# Altium project E-Card.PrjPCB
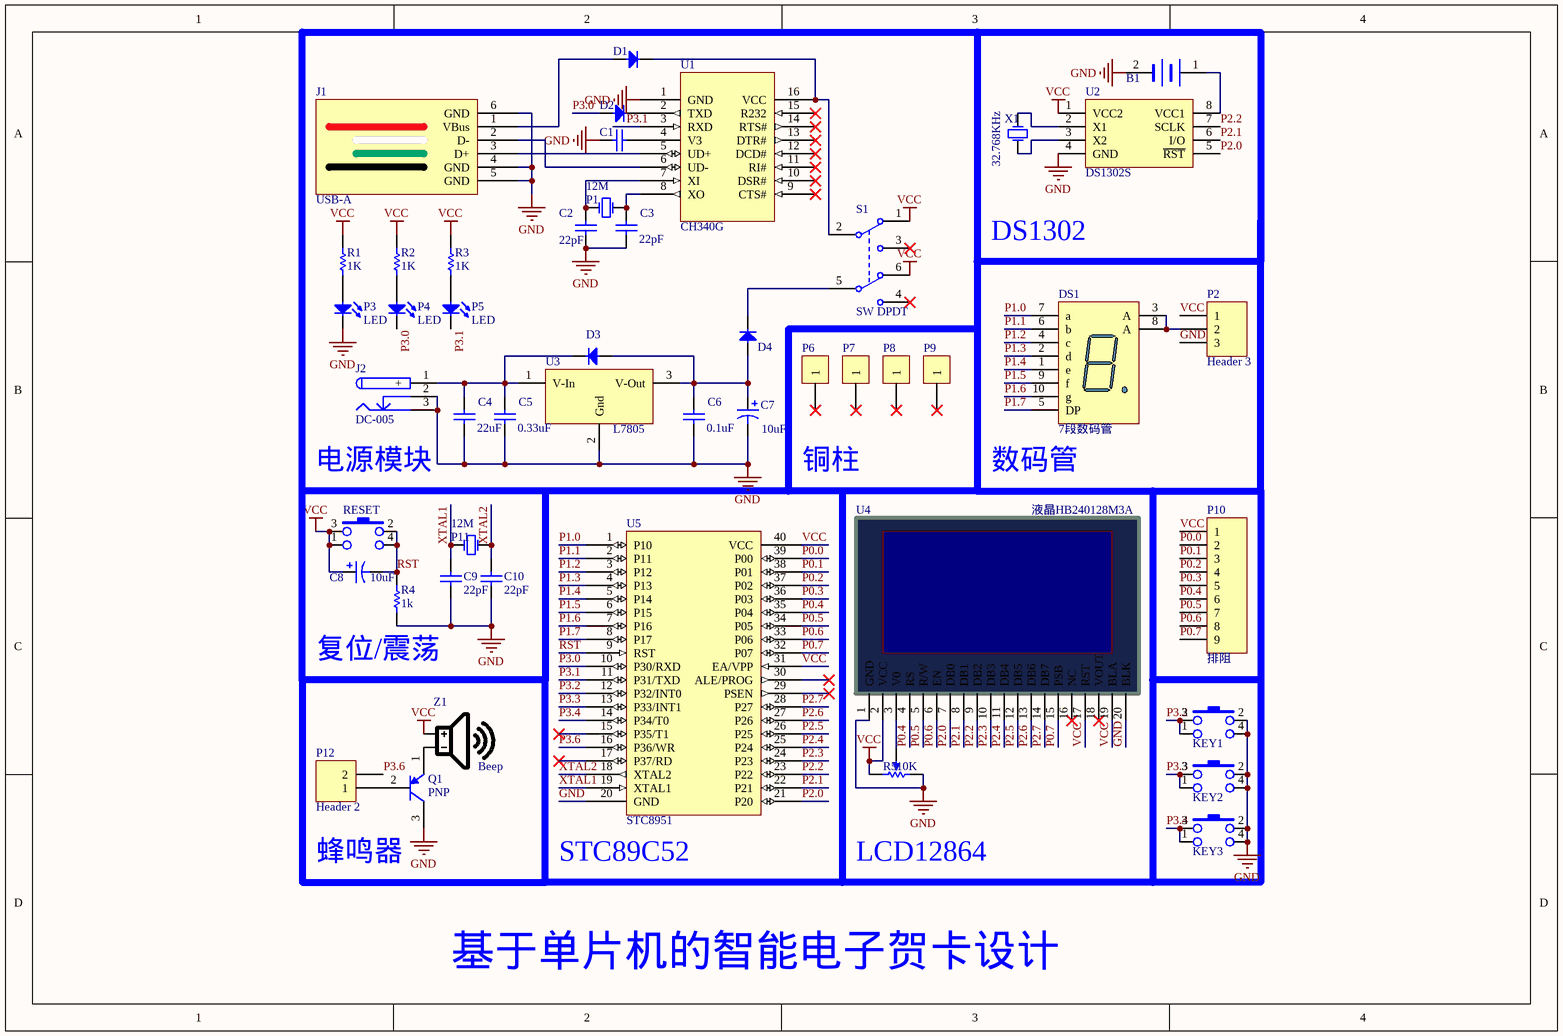
[diagram p0: E-Card.SchDoc]
1 sheet, 48 parts. Net scope: global (net labels, ports and power ports of the same name join across sheets).
Board file: E-Card.PcbDoc

## Sheet E-Card.SchDoc: 基于单片机的智能电子贺卡设计
size A4

### Parts
B1  CR1220  [BATTERY]  (value not drawn)
C1  0.1uF  [Cap]  (value not drawn)
C2  22pF  [Cap]
C3  22pF  [Cap]
C4  22uF  [Cap]
C5  0.33uF  [Cap]
C6  0.1uF  [Cap]
C7  10uF  [电解电容]
C8  10uF  [电解电容]
C9  22pF  [Cap]
C10  22pF  [Cap]
D1  Diode  [Diode]  (value not drawn)
D2  1N4007  [Diode]  (value not drawn)
D3  Diode  [Diode]  (value not drawn)
D4  Diode  [Diode]  (value not drawn)
DS1  7-Segment  [7-Segment]  (value not drawn)
J1  USB-A  [USB-A]
J2  DC-005  [DC JACK]
KEY1  SW-66B7  [SW-66]  (value not drawn)
KEY2  SW-66B7  [SW-66]  (value not drawn)
KEY3  SW-66B7  [SW-66]  (value not drawn)
P1  12M  [XTAL 12M]
P2  Header 3  [Header 3]
P3  LED  [LED]
P4  LED  [LED]
P5  LED  [LED]
P6  CU-M3X6-10  [CU-M3X6-10]  (value not drawn)
P7  CU-M3X6-10  [CU-M3X6-10]  (value not drawn)
P8  CU-M3X6-10  [CU-M3X6-10]  (value not drawn)
P9  CU-M3X6-10  [CU-M3X6-10]  (value not drawn)
P10  排阻  [排阻]
P11  12M  [XTAL 12M]
P12  Header 2  [Header 2]
Q1  PNP  [PNP]
R1  1K  [RES]
R2  1K  [RES]
R3  1K  [RES]
R4  1k  [RES]
R5  value 10K  [RPot]  (hidden comment: RPot)
RESET  SW-66B7  [SW-66]  (value not drawn)
S1  SW DPDT  [SW DPDT]
U1  CH340G  [CH340G]
U2  DS1302S  [DS1302]
U3  L7805  [L7805]
U4  液晶HB240128M3A  [LCD12864]
U5  STC8951  [STC8951]
X1  32.768KHz  [XTAL 32768]
Z1  Beep  [Beep]

### Nets
GND: B1.2(-) C1.1 C2.2 C3.2 C4.2 C5.2 C6.1 C7.2 C9.1 C10.1 J1.4(GND) J1.5(GND) J1.6(GND) J2.2 J2.3(-) KEY1.2 KEY1.4 KEY2.2 KEY2.4 KEY3.2 KEY3.4 P2.3 P3.2(K) Q1.3(C) R4.1 R5.2(TOP) U1.1(GND) U2.4(GND) U3.2(Gnd) U4.1(GND) U4.20(BLK) U5.20(GND)
VCC: C8.1 P2.1 P10.1 R1.2 R2.2 R3.2 R5.1(BOT) RESET.1 RESET.3 S1.1(NC1) S1.6(NC2) U2.1(VCC2) U4.2(VCC) U4.17(RST) U4.19(BLA) U5.31(EA/VPP) U5.40(VCC) Z1.1
P0.0: P10.2 U5.39(P00)
P0.1: P10.3 U5.38(P01)
P0.2: P10.4 U5.37(P02)
P0.3: P10.5 U5.36(P03)
P0.4: P10.6 U4.4(RS) U5.35(P04)
P0.5: P10.7 U4.5(R/W) U5.34(P05)
P0.6: P10.8 U4.6(EN) U5.33(P06)
P0.7: P10.9 U4.15(PSB) U5.32(P07)
P1.0: DS1.7(a) U5.1(P10)
P1.1: DS1.6(b) U5.2(P11)
P1.2: DS1.4(c) U5.3(P12)
P1.3: DS1.2(d) U5.4(P13)
P1.4: DS1.1(e) U5.5(P14)
P1.5: DS1.9(f) U5.6(P15)
P1.6: DS1.10(g) U5.7(P16)
P1.7: DS1.5(DP) U5.8(P17)
P2.0: U2.5(~{RST}) U4.7(DB0) U5.21(P20)
P2.1: U2.6(I/O) U4.8(DB1) U5.22(P21)
P2.2: U2.7(SCLK) U4.9(DB2) U5.23(P22)
P2.3: U4.10(DB3) U5.24(P23)
P2.4: U4.11(DB4) U5.25(P24)
P2.5: U4.12(DB5) U5.26(P25)
P2.6: U4.13(DB6) U5.27(P26)
P2.7: U4.14(DB7) U5.28(P27)
P3.0: D2.1(A) P4.2(K) U5.10(P30/RXD)
P3.1: P5.2(K) U1.3(RXD) U5.11(P31/TXD)
P3.2: KEY1.1 KEY1.3 U5.12(P32/INT0)
P3.3: KEY2.1 KEY2.3 U5.13(P33/INT1)
P3.4: KEY3.1 KEY3.3 U5.14(P34/T0)
P3.6: P12.2 U5.16(P36/WR)
RST: C8.2 R4.2 RESET.2 RESET.4 U5.9(RST)
XTAL1: C9.2 P11.1(OSC1) U5.19(XTAL1)
XTAL2: C10.2 P11.2(OSC2) U5.18(XTAL2)
NetB1_1: B1.1(+) U2.8(VCC1)
NetC1_2: C1.2 U1.4(V3)
NetC2_1: C2.1 P1.1(OSC1) U1.7(XI)
NetC3_1: C3.1 P1.2(OSC2) U1.8(XO)
NetC4_1: C4.1 C5.1 D3.2(K) J2.1(+) U3.1(V-In)
NetC6_2: C6.2 C7.1 D3.1(A) D4.1(A) U3.3(V-Out)
NetD1_1: D1.1(A) J1.1(VBus)
NetD1_2: D1.2(K) S1.2(COMMON1) U1.16(VCC)
NetD2_2: D2.2(K) U1.2(TXD)
NetD4_2: D4.2(K) S1.5(COMMON2)
NetDS1_3: DS1.3(A) DS1.8(A) P2.2
NetJ1_2: J1.2(D-) U1.6(UD-)
NetJ1_3: J1.3(D+) U1.5(UD+)
NetP3_1: P3.1(A) R1.1
NetP4_1: P4.1(A) R2.1
NetP5_1: P5.1(A) R3.1
NetP12_1: P12.1 Q1.2(B)
NetQ1_1: Q1.1(E) Z1.2
NetR5_3: R5.3(TAP) U4.3(V0)
NetU2_2: U2.2(X1) X1.1
NetU2_3: U2.3(X2) X1.2

Not connected (* = marked no-connect by the designer): P6 1*; P7 1*; P8 1*; P9 1*; S1 3(NO1)* 4(NO2)*; U1 9(CTS#)* 10(DSR#)* 11(RI#)* 12(DCD#)* 13(DTR#)* 14(RTS#)* 15(R232)*; U4 16(NC)* 18(VOUT)*; U5 15(P35/T1)* 17(P37/RD)* 29(PSEN)* 30(ALE/PROG)*

### Notes on the sheet
- DS1302
- 电源模块
- 铜柱
- (near DS1) 数码管
- (near R4) 复位/震荡
- 蜂鸣器
- (near U5) STC89C52
- LCD12864
- 基于单片机的智能电子贺卡设计
- (in symbol 7-Segment) 7段数码管

### Library data of the parts
B1 = BATTERY
C1-C6 C9 C10 = Cap: 普通电容
C7 C8 = 电解电容
D1 D3 D4 = Diode: 二极管; Published: 8-Jun-2000; LatestRevisionDate: 17-Jul-2002; LatestRevisionNote: Re-released for DXP Platform.; PackageDocument: Sep-1996; PackageReference: SMC; Publisher: Altium Limited; Code_JEDEC: DO-214-AB
D2 = Diode: 二极管Diode; Published: 8-Jun-2000; LatestRevisionDate: 17-Jul-2002; LatestRevisionNote: Re-released for DXP Platform.; PackageDocument: Sep-1996; PackageReference: SMC; Publisher: Altium Limited; Code_JEDEC: DO-214-AB
DS1 = 7-Segment: 14.2 mm General Purpose Blue 7-Segment Display: CA, RH DP, Gray Surface; MinimumIntensity: 2020 ucd; Note: IF = 10 mA; Published: 8-Jun-2000; LatestRevisionDate: 17-Dec-2003; LatestRevisionNote: Schematic revised, PCB Footprint replaced.; DatasheetVersion: 24-Sep-2002; PackageVersion: 24-Sep-2002; PackageReference: H; Publisher: Altium Limited; Colour: Blue; ComponentLink1Description: Manufacturer Link; ComponentLink1URL: http://www.agilent.com/
J2 = DC JACK: DC 电源座; Manufacturer: Kycon; Fitted: True
P1 P11 = XTAL 12M: 12MHZ振荡器 【2PIN】
P2 = Header 3: Header, 3-Pin; LatestRevisionDate: 17-Jul-2002; LatestRevisionNote: Re-released for DXP Platform.; Publisher: Altium Limited
P3-P5 = LED: LED灯
P6-P9 = CU-M3X6-10: 10mm长M3六角铜柱; LatestRevisionDate: 17-Jul-2002; LatestRevisionNote: Re-released for DXP Platform.; Publisher: Altium Limited
P10 = 排阻: Header, 9-Pin; LatestRevisionDate: 17-Jul-2002; LatestRevisionNote: Re-released for DXP Platform.; Publisher: Altium Limited
P12 = Header 2: 针座/孔座 180度; LatestRevisionDate: 17-Jul-2002; LatestRevisionNote: Re-released for DXP Platform.; Publisher: Altium Limited
Q1 = PNP: PNP Bipolar Transistor; Published: 8-Jun-2000; LatestRevisionDate: 17-Jul-2002; LatestRevisionNote: Re-released for DXP Platform.; PackageReference: SOT-23B; Publisher: Altium Limited; Code_JEDEC: SOT-23
R1-R4 = RES: 电阻
R5 = RPot: 可调 电阻; Sim Note: Enter the Resistance value and the set point into parameter fields.; Set Position: 0.5; Published: 8-Jun-2000; LatestRevisionDate: 17-Jul-2002; LatestRevisionNote: Re-released for DXP Platform.; PackageReference: VR5; Publisher: Altium Limited
S1 = SW DPDT: 自锁开关 （双刀双掷）; Published: 24-Mar-1999; LatestRevisionDate: 17-Jul-2002; LatestRevisionNote: Re-released for DXP Platform.; PackageReference: SOT23-6; Publisher: Altium Limited
U1 = CH340G: USB to TTL Serial / UART
U2 = DS1302: 时钟芯片 SOP127P780-8
U3 = L7805: 1.5A Vin:40V(max) Vout:5-24V -55 ~ 150°C LDO稳压器
U5 = STC8951: 51单片机
X1 = XTAL 32768: 32768HZ振荡器 【2PIN】
Z1 = Beep: 蜂鸣器